# Altium schematic sheet CH32F&V208G-R0.SchDoc
size 406 x 254 mm
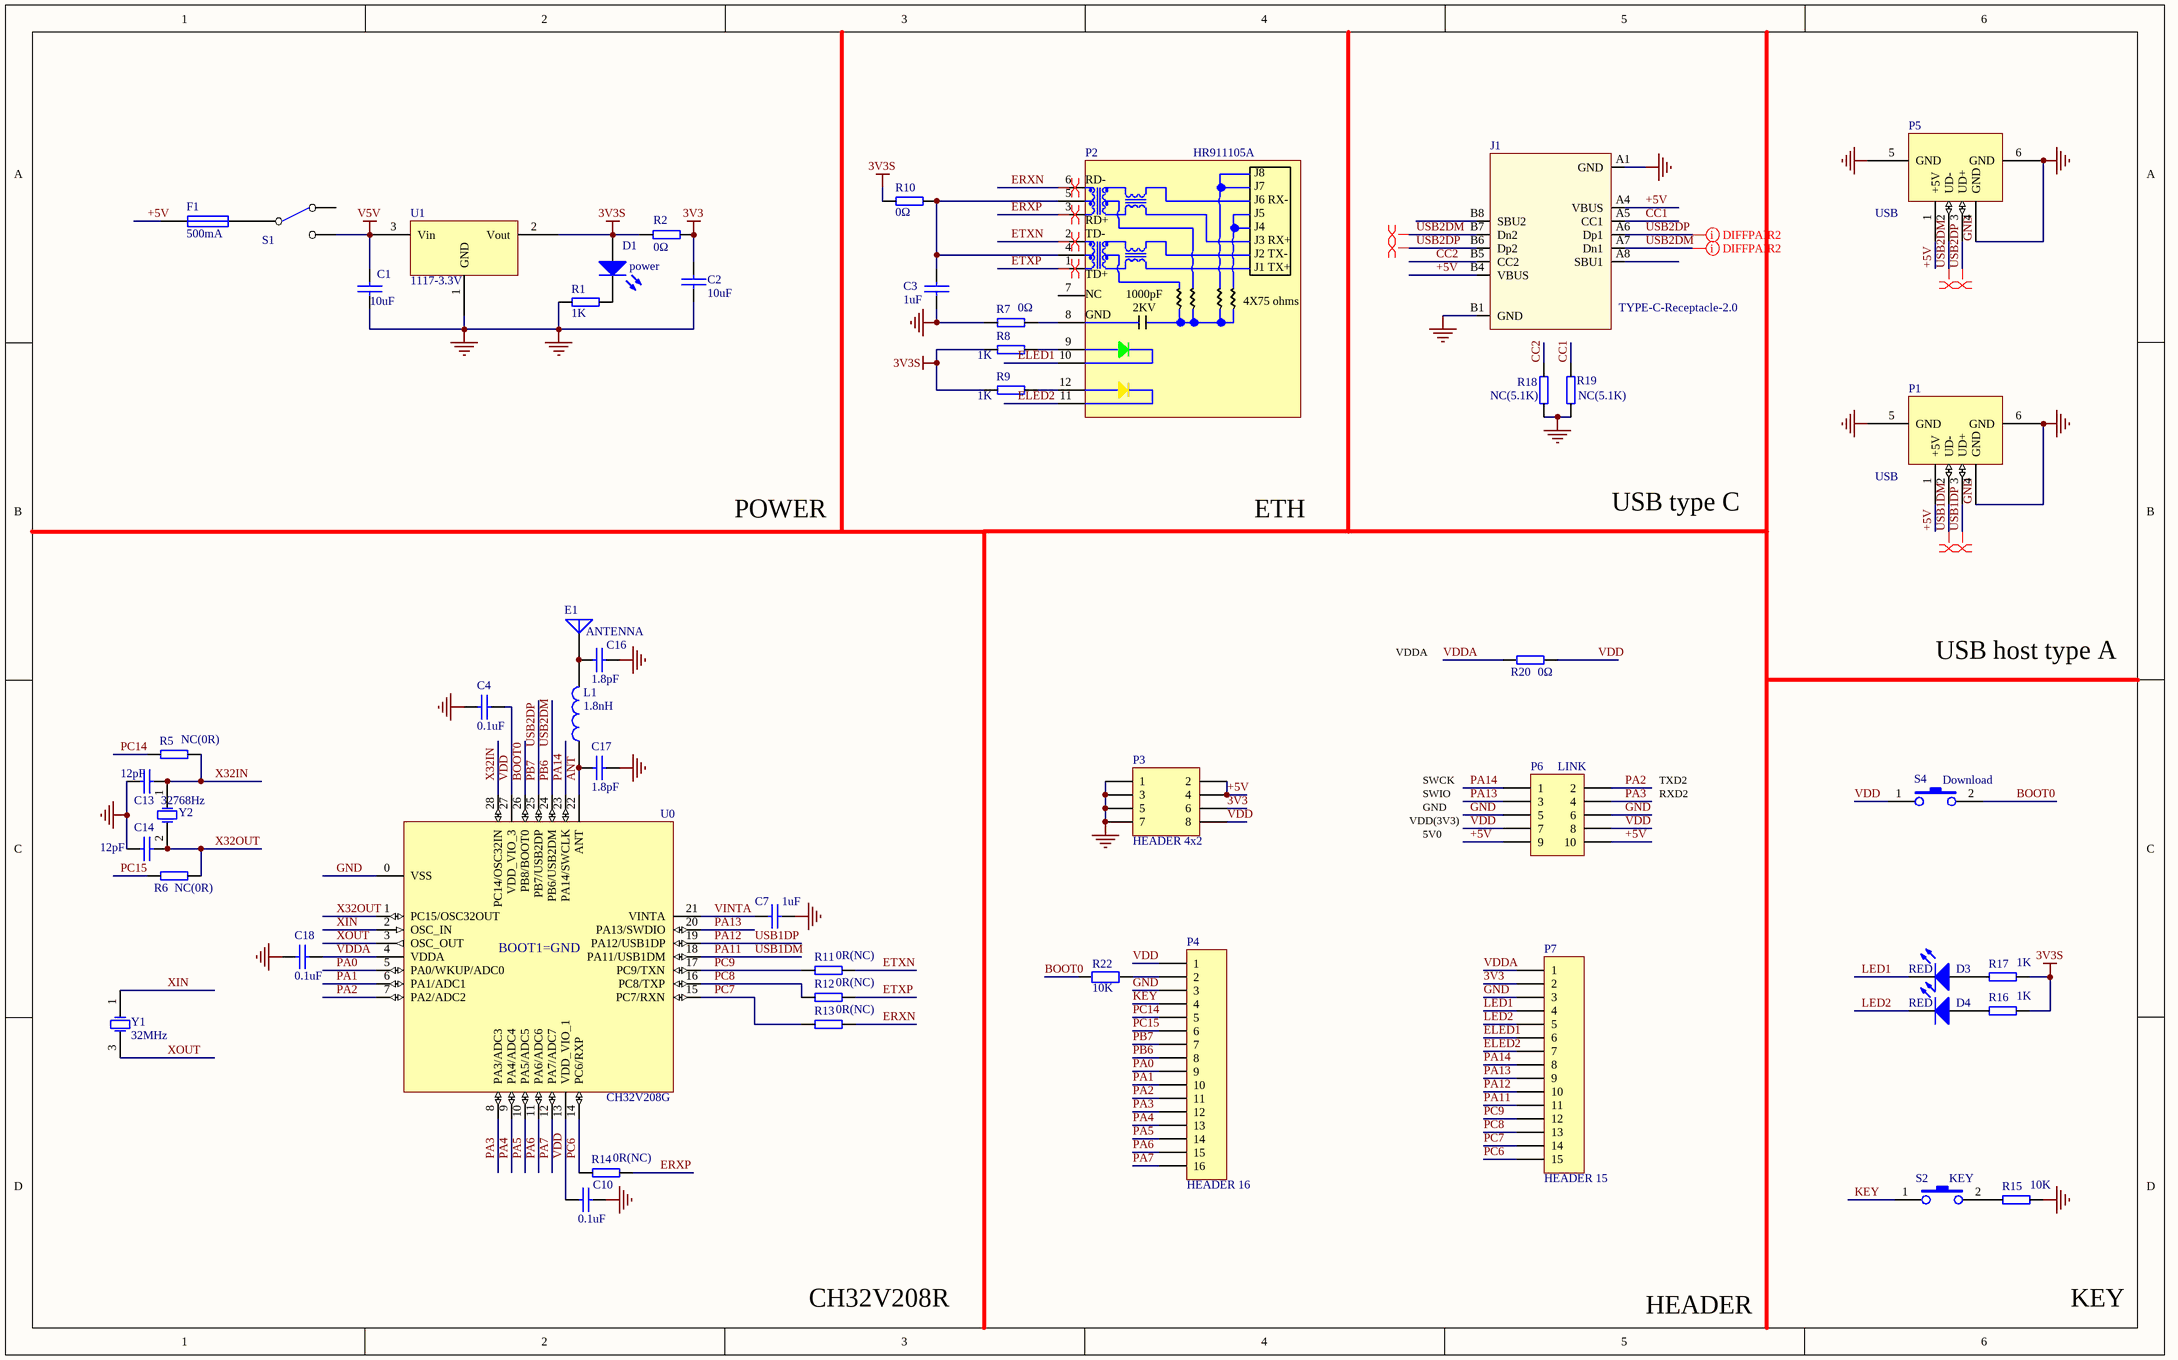
[diagram p0: CH32F&V208G-R0.SchDoc]

## Parts
C1  10uF  [3216_C]
C2  10uF  [0603_C]
C3  1uF  [0603_C]
C4  0.1uF  [0603_C]
C7  1uF  [0603_C]
C10  0.1uF  [0603_C]
C13  12pF  [0603_C]
C14  12pF  [0603_C]
C16  1.8pF  [0603_C]
C17  1.8pF  [0603_C]
C18  0.1uF  [0603_C]
D1  power  [0603+]
D3  RED  [0603+]
D4  RED  [0603+]
E1  ANTENNA  [ANT-F-1-2.4G-1.6mmFR4]
F1  500mA  [0603]
J1  TYPE-C-Receptacle-2.0  [TYPE-C-Receptacle-2.0]
L1  1.8nH  [0603]
P1  USB  [USBAF]
P2  HR911105A  [HR911105A]
P3  HEADER 4x2  [IDC8-2.54mm]
P4  HEADER 16  [SIP16-2.54mm]
P5  USB  [USBAF]
P6  LINK  [IDC10-2.54mm]
P7  HEADER 15  [SIP15-2.54mm]
R1  1K  [0603]
R2  0Ω  [0603]
R5  NC(0R)  [0603]
R6  NC(0R)  [0603]
R7  0Ω  [0603]
R8  1K  [0603]
R9  1K  [0603]
R10  0Ω  [0603]
R11  0R(NC)  [0603]
R12  0R(NC)  [0603]
R13  0R(NC)  [0603]
R14  0R(NC)  [0603]
R15  10K  [0603]
R16  1K  [0603]
R17  1K  [0603]
R18  NC(5.1K)  [0603]
R19  NC(5.1K)  [0603]
R20  0Ω  [0603]
R22  10K  [0603]
S1  SW SPDT  [SW1]  (value not drawn)
S2  KEY  [SMD_6.1x3.65x2.5mm-KEY]
S4  Download  [SMD_6.1x3.65x2.5mm-KEY]
U0  CH32V208G  [QFN28_4x4]
U1  1117-3.3V  [SOT-223]
Y1  32MHz  [XT3225]
Y2  32768Hz  [FC-135]

## Nets
3V3: C2.1 P3.6 P7.2 R2.1
3V3S: D1.1(A) R2.2 R8.1 R9.1 R10.2 R16.1 R17.1 U1.2(Vout)
GND: C1.2 C2.2 C3.1 C4.2 C7.2 C10.1 C13.1 C14.1 C16.1 C17.1 C18.2 J1.A1(GND) J1.B1(GND) P1.4(GND) P1.5(GND) P1.6(GND) P3.1 P3.3 P3.5 P3.7 P4.3 P5.4(GND) P5.5(GND) P5.6(GND) P6.5 P6.6 P7.3 R1.1 R7.1 R15.1 R18.2 R19.2 U0.0(VSS) U1.1(GND)
V5V: C1.1 S1.2(NC) U1.3(Vin)
+5V: F1.1 J1.A4(VBUS) J1.B4(VBUS) P1.1(+5V) P3.2 P3.4 P5.1(+5V) P6.9 P6.10
ANT: C17.2 L1.1 U0.22(ANT)
BOOT0: R22.1 S4.2 U0.26(PB8/BOOT0)
CC1: J1.A5(CC1) R19.1
CC2: J1.B5(CC2) R18.1
ELED1: P2.10 P7.6
ELED2: P2.11 P7.7
ERXN: P2.6 R13.2
ERXP: P2.3 R14.2
ETXN: P2.2 R11.2
ETXP: P2.1 R12.2
KEY: P4.4 S2.1
LED1: D3.2(K) P7.4
LED2: D4.2(K) P7.5
PA0: P4.9 U0.5(PA0/WKUP/ADC0)
PA1: P4.10 U0.6(PA1/ADC1)
PA2: P4.11 P6.2 U0.7(PA2/ADC2)
PA3: P4.12 P6.4 U0.8(PA3/ADC3)
PA4: P4.13 U0.9(PA4/ADC4)
PA5: P4.14 U0.10(PA5/ADC5)
PA6: P4.15 U0.11(PA6/ADC6)
PA7: P4.16 U0.12(PA7/ADC7)
PA11: P1.2(UD-) P7.11 U0.18(PA11/USB1DM)  [also labelled USB1DM]
PA12: P1.3(UD+) P7.10 U0.19(PA12/USB1DP)  [also labelled USB1DP]
PA13: P6.3 P7.9 U0.20(PA13/SWDIO)
PA14: P6.1 P7.8 U0.23(PA14/SWCLK)
PB6: J1.A7(Dn1) J1.B7(Dn2) P4.8 P5.2(UD-) U0.24(PB6/USB2DM)  [also labelled USB2DM]
PB7: J1.A6(Dp1) J1.B6(Dp2) P4.7 P5.3(UD+) U0.25(PB7/USB2DP)  [also labelled USB2DP]
PC6: P7.15 R14.1 U0.14(PC6/RXP)
PC7: P7.14 R13.1 U0.15(PC7/RXN)
PC8: P7.13 R12.1 U0.16(PC8/TXP)
PC9: P7.12 R11.1 U0.17(PC9/TXN)
PC14: P4.5 R5.1
PC15: P4.6 R6.1
VDD: C4.1 C10.2 P3.8 P4.1 P6.7 P6.8 R20.1 S4.1 U0.13(VDD_VIO_1) U0.27(VDD_VIO_3)
VDDA: C18.1 P7.1 R20.2 U0.4(VDDA)
VINTA: C7.1 U0.21(VINTA)
X32IN: C13.2 R5.2 U0.28(PC14/OSC32IN) Y2.1(OSC1)
X32OUT: C14.2 R6.2 U0.1(PC15/OSC32OUT) Y2.2(OSC2)
XIN: U0.2(OSC_IN) Y1.1(OSC1)
XOUT: U0.3(OSC_OUT) Y1.3(OSC2)
NetC3_2: C3.2 P2.4 P2.5 R10.1
NetC16_2: C16.2 E1.1(A) L1.2
NetD1_2: D1.2(K) R1.2
NetD3_1: D3.1(A) R17.2
NetD4_1: D4.1(A) R16.2
NetF1_2: F1.2 S1.1(COMMON)
NetP2_8: P2.8 R7.2
NetP2_9: P2.9 R8.2
NetP2_12: P2.12 R9.2
NetP4_2: P4.2 R22.2
NetR15_2: R15.2 S2.2

Not connected (* = marked no-connect by the designer): J1 A8(SBU1) B8(SBU2); P2 7; S1 3(NO)

## Layout directives
differential pair: ERXN, ERXP, ETXN, ETXP, PA11, PA12, PB6, PB7

## Notes on the sheet
- POWER
- ETH
- USB type C
- VDDA
- USB host type A
- VDD(3V3)
- SWCK
- SWIO
- 5V0
- GND
- TXD2
- RXD2
- CH32V208R
- KEY
- HEADER
- (in symbol CH32V208G) BOOT1=GND
- (in symbol HR911105A) J8; RD-; J7; J6; RX-; J5; RD+; J4; TD-; J3; RX+; J2; TX-; J1; TX+; TD+; NC; 1000pF; 4X75 ohms; 2KV; GND

## Library data of the parts
C1-C4 C7 C10 C13 C14 C16-C18 = CAP: Capacitor
D1 D3 D4 = LED0: Typical INFRARED GaAs LED; Published: 8-Jun-2000; LatestRevisionDate: 08-Jul-2005; LatestRevisionNote: Mech Layer 1 removed.; PackageReference: LED-0; Publisher: Altium Limited; PackageDescription: LED; 2 Leads
E1 = ANTENNA: Generic Antenna
F1 = FUSE1: Fuse
J1 = TYPE-C-Receptacle-2.0: Type-C USB2.0 母座
L1 = INDUCTOR
P1 P5 = USB: USB Port
P3 = HEADER 4x2: Header, 4-Pin, Dual row
P4 = HEADER 16: Header, 16-Pin
P6 = Header 5X2H: Header, 5-Pin, Dual row, Right Angle; LatestRevisionDate: 17-Jul-2002; LatestRevisionNote: Re-released for DXP Platform.; Publisher: Altium Limited
P7 = HEADER 15: Header, 15-Pin
R1 R2 R5-R19 = RES
R20 = R
R22 = Res2: Resistor
S2 S4 = KEY1
U0 = CH32V208G: RISC-V BLE5.3 MCU, 10M Ethernet, 2*USB, CAN
Y1 Y2 = XTAL: Crystal Oscillator; Published: 8-Jun-2000; LatestRevisionDate: 17-Jul-2002; LatestRevisionNote: Re-released for DXP Platform.; PackageReference: R38; Publisher: Altium Limited; PackageDescription: Crystal, Thru-Hole; 2 Leads; Body 3.1 x 8.2 mm (Dia.xH)